# Altium project LED_BLINK.PrjPcb
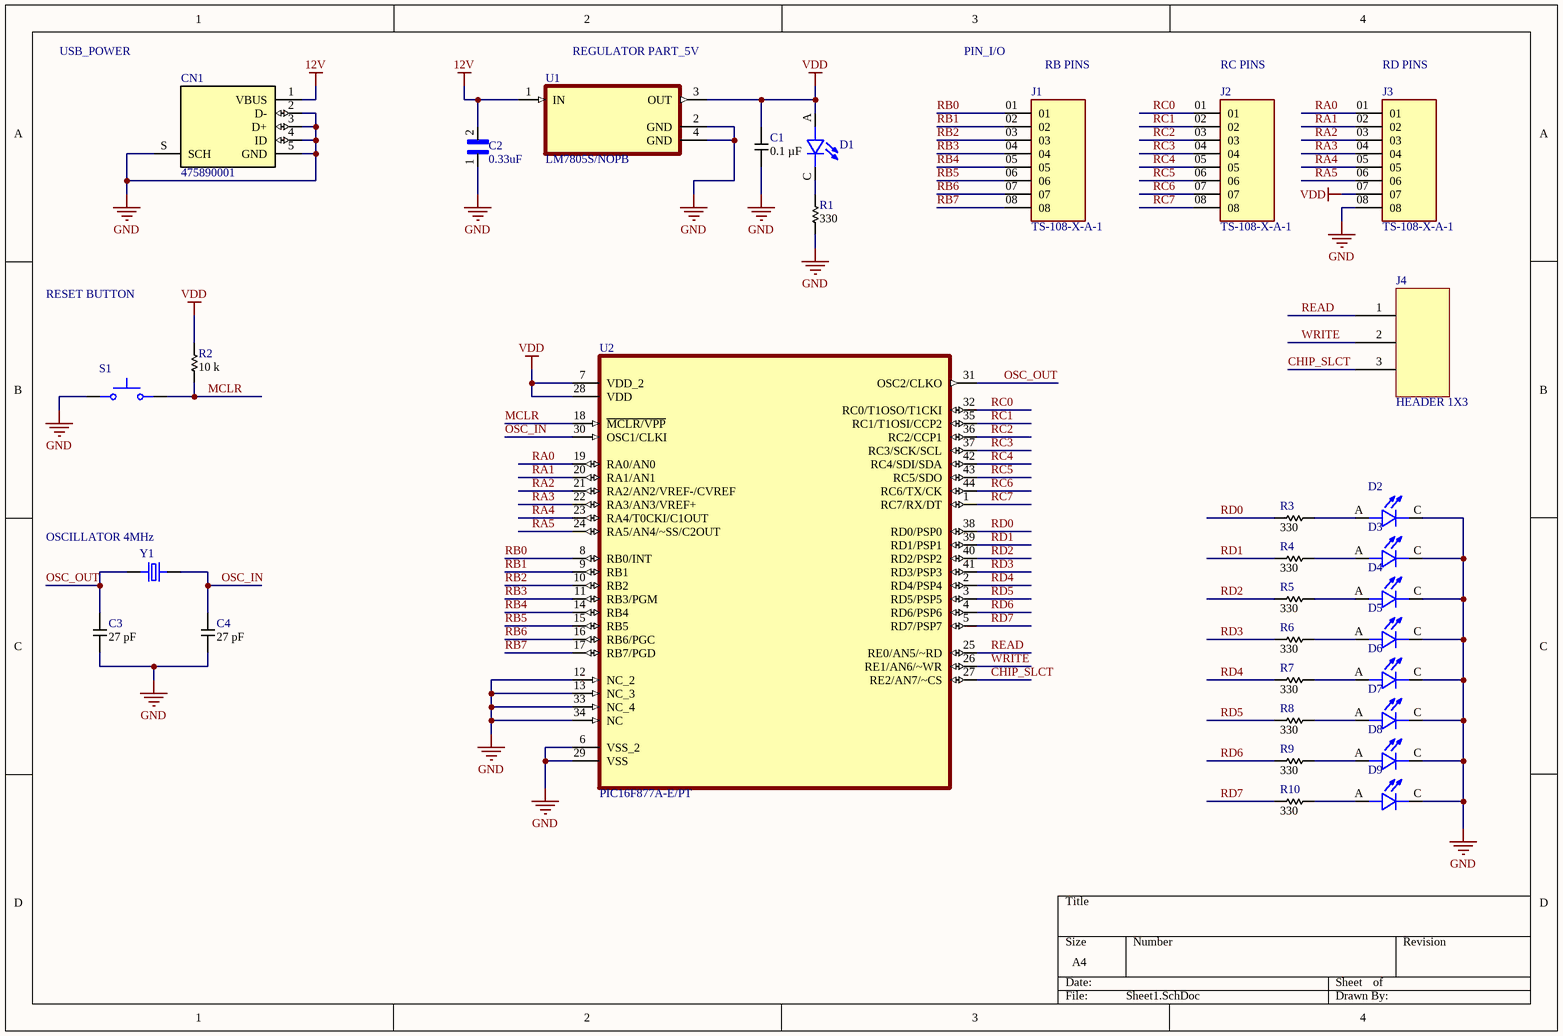
[diagram p0: Sheet1.SchDoc]
1 sheet, 32 parts. Net scope: global (net labels, ports and power ports of the same name join across sheets).
Board file: PCB1.PcbDoc

## Sheet Sheet1.SchDoc
size A4; SheetNumber: 1; SheetTotal: 1; SPICEModelCacheOJFWIMNS: <root> / <DocumentId>OJFWIMNS</DocumentId> / </root>

### Parts
C1  Capacitance: 0.1 µF  [SAMSUNG_CAP_0603_090]  (hidden comment: CL10B104KB8NNNC)
C2  0.33uF  [CAPC1608X90N]
C3  Capacitance: 27 pF  [SAMSUNG_CAP_0805_075]  (hidden comment: CL21C270JBANNNC)
C4  Capacitance: 27 pF  [SAMSUNG_CAP_0805_075]  (hidden comment: CL21C270JBANNNC)
CN1  475890001  [MOLEX_475890001]
D1  MP-2016-1100-30-80  [LED_MP-2016-1100-30-80]  (value not drawn)
D2  MP-2016-1100-30-80  [LED_MP-2016-1100-30-80]  (value not drawn)
D3  MP-2016-1100-30-80  [LED_MP-2016-1100-30-80]  (value not drawn)
D4  MP-2016-1100-30-80  [LED_MP-2016-1100-30-80]  (value not drawn)
D5  MP-2016-1100-30-80  [LED_MP-2016-1100-30-80]  (value not drawn)
D6  MP-2016-1100-30-80  [LED_MP-2016-1100-30-80]  (value not drawn)
D7  MP-2016-1100-30-80  [LED_MP-2016-1100-30-80]  (value not drawn)
D8  MP-2016-1100-30-80  [LED_MP-2016-1100-30-80]  (value not drawn)
D9  MP-2016-1100-30-80  [LED_MP-2016-1100-30-80]  (value not drawn)
J1  TS-108-X-A-1  [SAMTEC_TS-108-X-A-1]
J2  TS-108-X-A-1  [SAMTEC_TS-108-X-A-1]
J3  TS-108-X-A-1  [SAMTEC_TS-108-X-A-1]
J4  HEADER 1X3  [HEADER 1X3_2.54]
R1  Resistance: 330  [ROYALOHM_RES_0603]  (hidden comment: 0603SAJ0331T5E)
R2  Resistance: 10 k  [ROYALOHM_RES_0603]  (hidden comment: 0603SAJ0103T5E)
R3  Resistance: 330  [ROYALOHM_RES_0603]  (hidden comment: 0603SAJ0331T5E)
R4  Resistance: 330  [ROYALOHM_RES_0603]  (hidden comment: 0603SAJ0331T5E)
R5  Resistance: 330  [ROYALOHM_RES_0603]  (hidden comment: 0603SAJ0331T5E)
R6  Resistance: 330  [ROYALOHM_RES_0603]  (hidden comment: 0603SAJ0331T5E)
R7  Resistance: 330  [ROYALOHM_RES_0603]  (hidden comment: 0603SAJ0331T5E)
R8  Resistance: 330  [ROYALOHM_RES_0603]  (hidden comment: 0603SAJ0331T5E)
R9  Resistance: 330  [ROYALOHM_RES_0603]  (hidden comment: 0603SAJ0331T5E)
R10  Resistance: 330  [ROYALOHM_RES_0603]  (hidden comment: 0603SAJ0331T5E)
S1  800AWSP9M2QE  [SW_800AWSP9M2QE]  (value not drawn)
U1  LM7805S/NOPB  [TO254P1524X483-4N]
U2  PIC16F877A-E/PT  [QFP80P1200X1200X120-44N]
Y1  ECS-40-S-5PX-TR  [XTAL_ECS-40-S-5PX-TR]  (value not drawn)

### Nets
12V: C2.2 CN1.1(VBUS) U1.1(IN)
GND: C1.1 C2.1 C3.1 C4.1 CN1.2(D-) CN1.3(D+) CN1.4(ID) CN1.5(GND) CN1.S(SCH) D2.C D3.C D4.C D5.C D6.C D7.C D8.C D9.C J3.08 R1.1 S1.1 U1.2(GND) U1.4(GND) U2.6(VSS_2) U2.12(NC_2) U2.13(NC_3) U2.29(VSS) U2.33(NC_4) U2.34(NC)
VDD: C1.2 D1.A J3.07 R2.2 U1.3(OUT) U2.7(VDD_2) U2.28(VDD)
CHIP_SLCT: J4.3 U2.27(RE2/AN7/~CS)
MCLR: R2.1 S1.3 U2.18(~{MCLR/VPP})
OSC_IN: C4.2 U2.30(OSC1/CLKI) Y1.2
OSC_OUT: C3.2 U2.31(OSC2/CLKO) Y1.1
RA0: J3.01 U2.19(RA0/AN0)
RA1: J3.02 U2.20(RA1/AN1)
RA2: J3.03 U2.21(RA2/AN2/VREF-/CVREF)
RA3: J3.04 U2.22(RA3/AN3/VREF+)
RA4: J3.05 U2.23(RA4/T0CKI/C1OUT)
RA5: J3.06 U2.24(RA5/AN4/~SS/C2OUT)
RB0: J1.01 U2.8(RB0/INT)
RB1: J1.02 U2.9(RB1)
RB2: J1.03 U2.10(RB2)
RB3: J1.04 U2.11(RB3/PGM)
RB4: J1.05 U2.14(RB4)
RB5: J1.06 U2.15(RB5)
RB6: J1.07 U2.16(RB6/PGC)
RB7: J1.08 U2.17(RB7/PGD)
RC0: J2.01 U2.32(RC0/T1OSO/T1CKI)
RC1: J2.02 U2.35(RC1/T1OSI/CCP2)
RC2: J2.03 U2.36(RC2/CCP1)
RC3: J2.04 U2.37(RC3/SCK/SCL)
RC4: J2.05 U2.42(RC4/SDI/SDA)
RC5: J2.06 U2.43(RC5/SDO)
RC6: J2.07 U2.44(RC6/TX/CK)
RC7: J2.08 U2.1(RC7/RX/DT)
RD0: R3.1 U2.38(RD0/PSP0)
RD1: R4.1 U2.39(RD1/PSP1)
RD2: R5.1 U2.40(RD2/PSP2)
RD3: R6.1 U2.41(RD3/PSP3)
RD4: R7.1 U2.2(RD4/PSP4)
RD5: R8.1 U2.3(RD5/PSP5)
RD6: R9.1 U2.4(RD6/PSP6)
RD7: R10.1 U2.5(RD7/PSP7)
READ: J4.1 U2.25(RE0/AN5/~RD)
WRITE: J4.2 U2.26(RE1/AN6/~WR)
NetD1_C: D1.C R1.2
NetD2_A: D2.A R3.2
NetD3_A: D3.A R4.2
NetD4_A: D4.A R5.2
NetD5_A: D5.A R6.2
NetD6_A: D6.A R7.2
NetD7_A: D7.A R8.2
NetD8_A: D8.A R9.2
NetD9_A: D9.A R10.2

### Notes on the sheet
- USB_POWER
- (near U1) REGULATOR PART_5V
- PIN_I/O
- (near J1) RB PINS
- (near J2) RC PINS
- (near J3) RD PINS
- RESET BUTTON
- (near Y1) OSCILLATOR 4MHz

### Library data of the parts
C1 = CL10B104KB8NNNC: CAP CER 0.1UF 50V X7R 0603; Supplier 1: Digi-Key; Supplier 2: Mouser; Supplier 3: Arrow Electronics; Supplier Part Number 1: 1276-1000-6-ND; Supplier Part Number 2: 187-CL10B104KB8NNNC; Supplier Part Number 3: CL10B104KB8NNNC
C2 = C1608X7R1H334K080AC: 0.33 ÂµF Â±10% 50V Ceramic Capacitor X7R 0603 (1608 Metric); MF: TDK; SnapEDA_Link: https://www.snapeda.com/parts/C1608X7R1H334K080AC/TDK/view-part/?ref=snap; Package: 1608 TDK; MP: C1608X7R1H334K080AC; Value: *; Check_prices: https://www.snapeda.com/parts/C1608X7R1H334K080AC/TDK/view-part/?ref=eda; Availability: Not in stock; Price: None
C3 C4 = CL21C270JBANNNC: CAP CER 27PF 50V C0G/NP0 0805; Supplier 1: Digi-Key; Supplier Part Number 1: 1276-1285-1-ND
CN1 = 475890001: CONN RCPT MICRO USB AB 5P SMD RA; Supplier 1: Digi-Key; Supplier 2: Farnell; Supplier 3: Mouser; Supplier 4: Arrow Electronics; Supplier Part Number 1: WM17143CT-ND; Supplier Part Number 2: 3500670; Supplier Part Number 3: 538-47589-0001; Supplier Part Number 4: 47589-0001
D1-D9 = MP-2016-1100-30-80: LED Midpower Lighting series White, warm 3000K, 80 CRI, 27lm 3V 120mA 110Â°; MF: Luminus Devices; Purchase-URL: https://pricing.snapeda.com/search/part/MP-2016-1100-30-80/?ref=eda; Price: None; SnapEDA_Link: https://www.snapeda.com/parts/MP-2016-1100-30-80/Luminus+Devices+Inc./view-part/?ref=snap; MP: MP-2016-1100-30-80; Value: *; Availability: In Stock; Check_prices: https://www.snapeda.com/parts/MP-2016-1100-30-80/Luminus+Devices+Inc./view-part/?ref=eda; Package: None
J1-J3 = TS-108-X-A-1: TS Series .100 Single Row Screw Machine Terminal Strip; MP: TS-108-G-A-1; MF: Samtec; Availability: Bad; Value: *; Check_prices: https://www.snapeda.com/parts/TS-108-G-A-1/Samtec/view-part/4699387/?ref=eda; Package: None; Price: None; SnapEDA_Link: https://www.snapeda.com/parts/TS-108-G-A-1/Samtec/view-part/4699387/?ref=snap
R1 R3-R10 = 0603SAJ0331T5E: RES SMD 330R OHM 5% 1/10W 0603
R2 = 0603SAJ0103T5E: RES SMD 10K OHM 5% 1/10W 0603
S1 = 800AWSP9M2QE: Pushbutton Switch SPST-NO Standard Through Hole; MF: E-Switch; Availability: In Stock; SnapEDA_Link: https://www.snapeda.com/parts/800AWSP9M2QE/E-Switch/view-part/?ref=snap; Check_prices: https://www.snapeda.com/parts/800AWSP9M2QE/E-Switch/view-part/?ref=eda; Price: None; Package: None; Purchase-URL: https://pricing.snapeda.com/search/part/800AWSP9M2QE/?ref=eda; MP: 800AWSP9M2QE; Value: *
U1 = LM7805S/NOPB: 1.5-A, 30-V, linear voltage regulator; MF: Texas Instruments; Check_prices: https://www.snapeda.com/parts/LM7805S/NOPB/Texas+Instruments/view-part/?ref=eda; Value: *; Availability: In Stock; MP: LM7805S/NOPB; Price: None; Package: TO-263-3 Texas Instruments; SnapEDA_Link: https://www.snapeda.com/parts/LM7805S/NOPB/Texas+Instruments/view-part/?ref=snap; Purchase-URL: https://pricing.snapeda.com/search/part/LM7805S/NOPB/?ref=eda
U2 = PIC16F877A-E/PT: PIC PICÂ® 16F Microcontroller IC 8-Bit 20MHz 14KB _8K x 14_ FLASH 44-TQFP _10x10_; MF: Microchip; Package: TQFP-44 Microchip; Value: *; Availability: Unavailable; SnapEDA_Link: https://www.snapeda.com/parts/PIC16F877A-E/PT/Microchip/view-part/39702/?ref=snap; Price: None; MP: PIC16F877A-E/PT
Y1 = ECS-40-S-5PX-TR: 4MHz Â±30ppm Crystal Series 150 Ohms HC-49/US; MF: ECS Inc.; SnapEDA_Link: https://www.snapeda.com/parts/ECS-40-S-5PX-TR/ECS%20Inc./view-part/2766905/?ref=snap; Price: None; MP: ECS-40-S-5PX-TR; Package: HC49/US ECS International; Value: *; Availability: Unavailable